# Altium schematic sheet ESP-RX.SchDoc: ESP-RX
size A; SheetNumber: 3; SheetTotal: 8
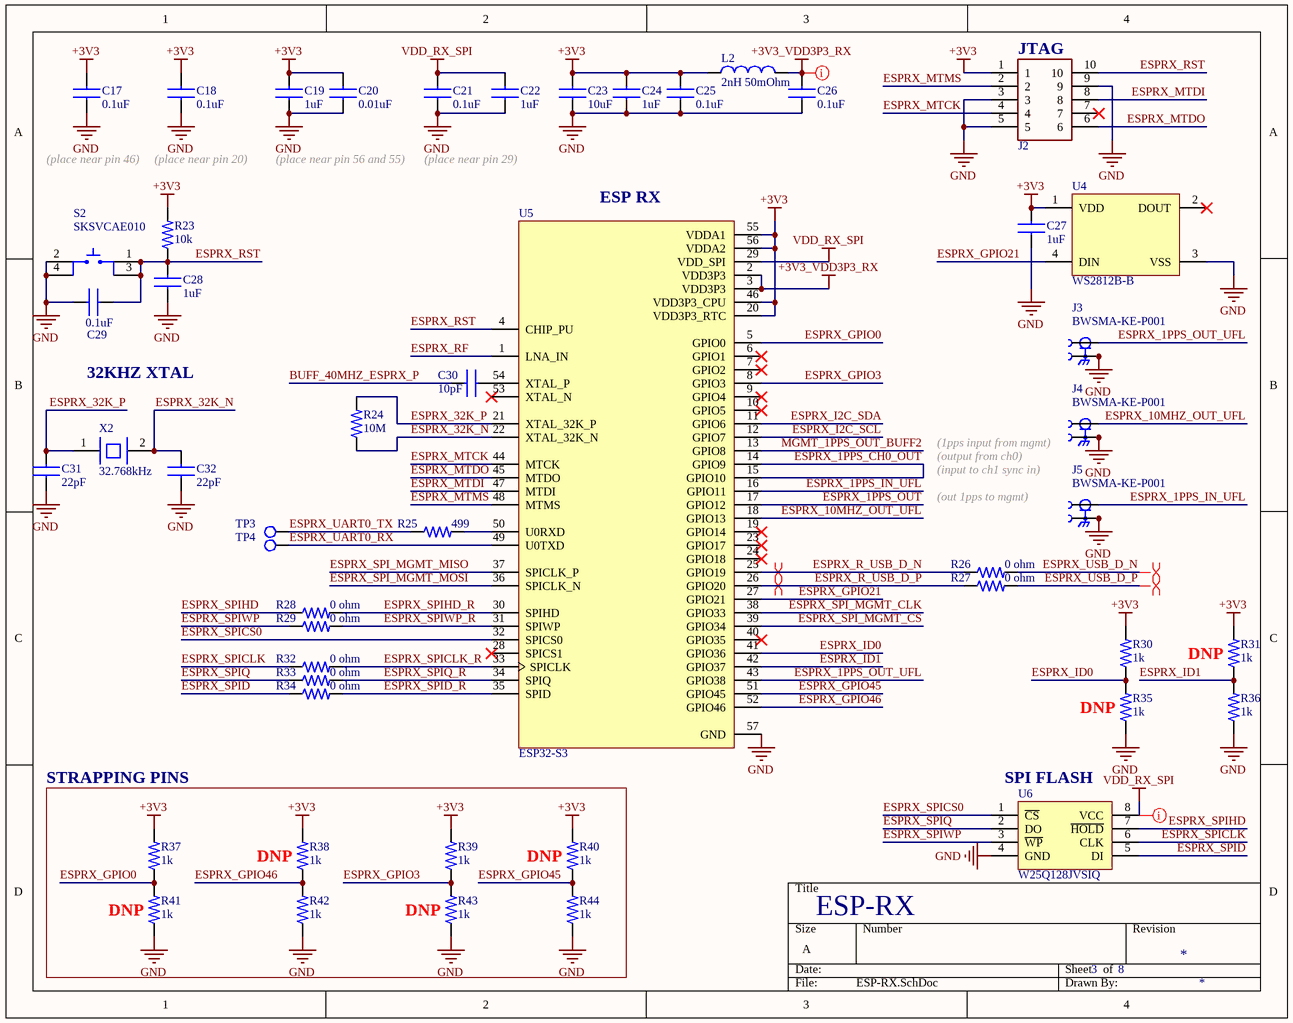
[diagram p0: ESP-RX.SchDoc]

## Parts
C17  0.1uF  [CAP_0402]
C18  0.1uF  [CAP_0402]
C19  1uF  [CAP_0402]
C20  0.01uF  [CAP_0402]
C21  0.1uF  [CAP_0402]
C22  1uF  [CAP_0402]
C23  10uF  [CAP_0402]
C24  1uF  [CAP_0402]
C25  0.1uF  [CAP_0402]
C26  0.1uF  [CAP_0402]
C27  1uF  [CAP_0402]
C28  1uF  [CAP_0402]
C29  0.1uF  [CAP_0402]
C30  10pF  [CAP_0402]
C31  22pF  [CAP_0402]
C32  22pF  [CAP_0402]
J2  CONN_TC2050-IDC  [CONN_TAG-CONNECT_TC2050-IDC]  (value not drawn)
J3  BWSMA-KE-P001  [CONN_BWSMA-KE-P001]
J4  BWSMA-KE-P001  [CONN_BWSMA-KE-P001]
J5  BWSMA-KE-P001  [CONN_BWSMA-KE-P001]
L2  2nH 50mOhm  [IND_INDC1006X60N]
R23  10k  [RES_0402]
R24  10M  [RES_0402]
R25  499  [RES_0402]
R26  0 ohm  [RES_0402]
R27  0 ohm  [RES_0402]
R28  0 ohm  [RES_0402]
R29  0 ohm  [RES_0402]
R30  1k  [RES_0402]
R31  1k  [RES_0402]  (no BOM)
R32  0 ohm  [RES_0402]
R33  0 ohm  [RES_0402]
R34  0 ohm  [RES_0402]
R35  1k  [RES_0402]  (no BOM)
R36  1k  [RES_0402]
R37  1k  [RES_0402]
R38  1k  [RES_0402]  (no BOM)
R39  1k  [RES_0402]
R40  1k  [RES_0402]  (no BOM)
R41  1k  [RES_0402]  (no BOM)
R42  1k  [RES_0402]
R43  1k  [RES_0402]  (no BOM)
R44  1k  [RES_0402]
S2  SKSVCAE010  [SW_SKSVCAE010]
TP3  Test Point 1MM  [TP_PAD-1MM]  (value not drawn)  (no BOM)
TP4  Test Point 1MM  [TP_PAD-1MM]  (value not drawn)  (no BOM)
U4  WS2812B-B  [LED_WS2812B-B]
U5  ESP32-S3  [IC_ESP32-S3]
U6  W25Q128JVSIQ  [IC_W25Q128JVSIQ]
X2  32.768kHz  [XTAL_X321532768KGD2SI]

## Nets
+3V3: C17.2 C18.2 C19.2 C20.2 C23.2 C24.2 C25.2 C27.2 J2.1 L2.1 R23.2 R30.2 R31.2 R37.2 R38.2 R39.2 R40.2 U4.1(VDD) U5.20(VDD3P3_RTC) U5.46(VDD3P3_CPU) U5.55(VDDA1) U5.56(VDDA2)
+3V3_VDD3P3_RX: C26.2 L2.2 U5.2(VDD3P3) U5.3(VDD3P3)
GND: C17.1 C18.1 C19.1 C20.1 C21.1 C22.1 C23.1 C24.1 C25.1 C26.1 C27.1 C28.1 C29.1 C31.1 C32.1 J2.3 J2.5 J2.9 J3.2 J3.3 J3.4 J3.5 J4.2 J4.3 J4.4 J4.5 J5.2 J5.3 J5.4 J5.5 R35.1 R36.1 R41.1 R42.1 R43.1 R44.1 S2.2 S2.4 U4.3(VSS) U5.57(GND) U6.4(GND)
VDD_RX_SPI: C21.2 C22.2 U5.29(VDD_SPI) U6.8(VCC)
BUFF_40MHZ_ESPRX_P: C30.1
ESPRX_1PPS_CH0_OUT: U5.14(GPIO9) U5.15(GPIO10)
ESPRX_1PPS_IN_UFL: J5.1 U5.16(GPIO11)
ESPRX_1PPS_OUT: U5.17(GPIO12)
ESPRX_1PPS_OUT_UFL: J3.1 U5.43(GPIO38)
ESPRX_10MHZ_OUT_UFL: J4.1 U5.18(GPIO13)
ESPRX_32K_N: C32.2 R24.1 U5.22(XTAL_32K_N) X2.2(GND)
ESPRX_32K_P: C31.2 R24.2 U5.21(XTAL_32K_P) X2.1(IN/OUT)
ESPRX_GPIO0: R37.1 R41.2 U5.5(GPIO0)
ESPRX_GPIO3: R39.1 R43.2 U5.8(GPIO3)
ESPRX_GPIO21: U4.4(DIN) U5.27(GPIO21)
ESPRX_GPIO45: R40.1 R44.2 U5.51(GPIO45)
ESPRX_GPIO46: R38.1 R42.2 U5.52(GPIO46)
ESPRX_I2C_SCL: U5.12(GPIO7)
ESPRX_I2C_SDA: U5.11(GPIO6)
ESPRX_ID0: R30.1 R35.2 U5.41(GPIO36)
ESPRX_ID1: R31.1 R36.2 U5.42(GPIO37)
ESPRX_MTCK: J2.4 U5.44(MTCK)
ESPRX_MTDI: J2.8 U5.47(MTDI)
ESPRX_MTDO: J2.6 U5.45(MTDO)
ESPRX_MTMS: J2.2 U5.48(MTMS)
ESPRX_R_USB_D_N: R26.1 U5.25(GPIO19)
ESPRX_R_USB_D_P: R27.1 U5.26(GPIO20)
ESPRX_RF: U5.1(LNA_IN)
ESPRX_RST: C28.2 C29.2 J2.10 R23.1 S2.1 S2.3 U5.4(CHIP_PU)
ESPRX_SPI_MGMT_CLK: U5.38(GPIO33)
ESPRX_SPI_MGMT_CS: U5.39(GPIO34)
ESPRX_SPI_MGMT_MISO: U5.37(SPICLK_P)
ESPRX_SPI_MGMT_MOSI: U5.36(SPICLK_N)
ESPRX_SPICLK: R32.1 U6.6(CLK)
ESPRX_SPICLK_R: R32.2 U5.33(SPICLK)
ESPRX_SPICS0: U5.32(SPICS0) U6.1(~{CS})
ESPRX_SPID: R34.1 U6.5(DI)
ESPRX_SPID_R: R34.2 U5.35(SPID)
ESPRX_SPIHD: R28.1 U6.7(~{HOLD})
ESPRX_SPIHD_R: R28.2 U5.30(SPIHD)
ESPRX_SPIQ: R33.1 U6.2(DO)
ESPRX_SPIQ_R: R33.2 U5.34(SPIQ)
ESPRX_SPIWP: R29.1 U6.3(~{WP})
ESPRX_SPIWP_R: R29.2 U5.31(SPIWP)
ESPRX_UART0_RX: TP4.1 U5.49(U0TXD)
ESPRX_UART0_TX: R25.1 TP3.1
ESPRX_USB_D_N: R26.2
ESPRX_USB_D_P: R27.2
MGMT_1PPS_OUT_BUFF2: U5.13(GPIO8)
NetC30_2: C30.2 U5.54(XTAL_P)
NetR25_2: R25.2 U5.50(U0RXD)

Not connected (* = marked no-connect by the designer): J2 7*; U4 2(DOUT)*; U5 6(GPIO1)* 7(GPIO2)* 9(GPIO4)* 10(GPIO5)* 19(GPIO14)* 23(GPIO17)* 24(GPIO18)* 28(SPICS1)* 40(GPIO35)* 53(XTAL_N)*

## Layout directives
differential pair: ESPRX_R_USB_D_N, ESPRX_R_USB_D_P, ESPRX_USB_D_N, ESPRX_USB_D_P
net class Power: +3V3_VDD3P3_RX, VDD_RX_SPI

## Notes on the sheet
- (near J2) JTAG
- (place near pin 46)
- (place near pin 20)
- (place near pin 56 and 55)
- (place near pin 29)
- (near U5) ESP RX
- 32KHZ XTAL
- (input to ch1 sync in)
- (output from ch0)
- (near J5) (out 1pps to mgmt)
- (near J4) (1pps input from mgmt)
- (near R35) DNP
- (near R31) DNP
- STRAPPING PINS
- (near U6) SPI FLASH
- (near R41) DNP
- (near R38) DNP
- (near R43) DNP
- (near R40) DNP

## Library data of the parts
C17 C18 C21 C25 C26 C29 = CAP_GCM155R71C104KA55J: Cap Ceramic 0.1uF 16V X7R 10% SMD 0402 125C Paper T/R; Manufacturer: Murata; Capacitance: 100nF; Supplier 1: Digi-Key; Manufacturer Part Number: GCM155R71C104KA55J; RoHS: Yes; Category: Ceramic Capacitors; Stock 1: 10738061; Pricing 1: 1=0.10000, 10=0.03500, 50=0.01920, 100=0.01560, 500=0.01116, 1000=0.00877, 2500=0.00798, 5000=0.00734 (USD); Mount: Surface Mount; Case/Package: 0402; Case Code (Imperial): 0402; Case Code (Metric): 1005; Min Operating Temperature: -55°C; Max Operating Temperature: 125°C; Tolerance: 10%; Voltage Rating: 16V; Voltage Rating (DC): 16V; Packaging: Tape and Reel; Package Quantity: 1; Dielectric: X7R; Termination: SMD/SMT; Series: GCM; Construction: Flat; Length: 1mm; Width: 0.5mm; Height: 0.5mm; Thickness: 0.022inch; Depth: 0.5mm; Ratings: AEC-Q200; Radiation Hardening: No; Lead Free: Lead Free; ComponentLink1URL: https://datasheet.ciiva.com/11618/product-11618848.pdf?src-supplier=Avnet; ComponentLink1Description: https://datasheet.ciiva.com/11618/product-11618848.pdf?src-supplier=Avnet; ComponentLink2URL: https://datasheet.ciiva.com/16440/gcm155r71c104ka55j-16440393.pdf?src-supplier=Future+Electronics; ComponentLink2Description: https://datasheet.ciiva.com/16440/gcm155r71c104ka55j-16440393.pdf?src-supplier=Future+Electronics; ComponentLink3URL: https://datasheet.ciiva.com/29542/product-29542474.pdf?src-supplier=Digi-Key; ComponentLink3Description: https://datasheet.ciiva.com/29542/product-29542474.pdf?src-supplier=Digi-Key; ComponentLink4URL: https://datasheet.ciiva.com/29542/product-29542475.pdf?src-supplier=Digi-Key; ComponentLink4Description: https://datasheet.ciiva.com/29542/product-29542475.pdf?src-supplier=Digi-Key; Supplier Part Number 1: 490-7998-1-ND
C19 C22 C24 C27 C28 = CAP_CL05A105KA5NQNC: Cap Ceramic 1uF 25V X5R 10% SMD 0402 85°C Cardboard T/R; Manufacturer: Samsung; Supplier 1: Digi-Key; Manufacturer Part Number: CL05A105KA5NQNC; RoHS: Yes; Category: Ceramic Capacitors; Pricing 1: 1=0.21000, 10=0.14900, 50=0.08460, 100=0.07000, 500=0.04910, 1000=0.04065, 2500=0.03784, 5000=0.03462 (USD); Mount: Surface Mount; Case/Package: 0402; Case Code (Metric): 1005; Case Code (Imperial): 0402; Material: Ceramic; Min Operating Temperature: -55°C; Max Operating Temperature: 85°C; Tolerance: 10%; Capacitance: 1uF; Voltage Rating: 25V; Packaging: Tape and Reel; Package Quantity: 10000; Dielectric: X5R; Series: CL; Construction: Flat; Length: 1mm; Width: 0.02inch; Height: 0.5mm; Depth: 0.5mm; Thickness: 0.022inch; Radiation Hardening: No; Lead Free: Lead Free; RoHS Compliant: Yes; ComponentLink1URL: https://datasheet.ciiva.com/3777/cl05a105ka5nqnc-3777709.pdf?src-supplier=Arrow+Electronics; ComponentLink1Description: https://datasheet.ciiva.com/3777/cl05a105ka5nqnc-3777709.pdf?src-supplier=Arrow+Electronics; ComponentLink2URL: https://datasheet.ciiva.com/25720/cl05a105ka5nqnc-25720771.pdf?src-supplier=Digi-Key; ComponentLink2Description: https://datasheet.ciiva.com/25720/cl05a105ka5nqnc-25720771.pdf?src-supplier=Digi-Key; ComponentLink3URL: https://datasheet.ciiva.com/29198/459147-da-01-en-vs-kondensator-0402-29198339.pdf?src-supplier=Conrad; ComponentLink3Description: https://datasheet.ciiva.com/29198/459147-da-01-en-vs-kondensator-0402-29198339.pdf?src-supplier=Conrad; Supplier Part Number 1: 1276-1445-6-ND
C20 = CAP_CC0402KRX7R9BB103: Cap Ceramic 0.01uF 50V X7R 10% Pad SMD 0402 125°C T/R; Manufacturer: Yageo; Capacitance: 10nF; Supplier 1: Digi-Key; Manufacturer Part Number: CC0402KRX7R9BB103; RoHS: Yes; Category: Ceramic Capacitors; Stock 1: 2049089; Pricing 1: 1=0.10000, 10=0.01800, 50=0.01000, 100=0.00820, 500=0.00588, 1000=0.00462, 2500=0.00420, 5000=0.00386 (USD); Mount: Surface Mount; Case/Package: 0402; Case Code (Imperial): 0402; Case Code (Metric): 1005; Min Operating Temperature: -55°C; Max Operating Temperature: 125°C; Tolerance: 10%; Dielectric: X7R; Packaging: Tape and Reel; Voltage Rating: 50V; Voltage Rating (DC): 50V; Package Quantity: 1; Termination: SMD/SMT; Resistor Type: Ceramic; Voltage: 50V; Series: CC; Length: 1mm; Width: 0.5mm; Height: 0.5mm; Thickness: 0.022inch; Depth: 0.5mm; Radiation Hardening: No; RoHS Compliant: Yes; REACH SVHC: No SVHC; Lead Free: Lead Free; Halogen Free: Halogen Free; ComponentLink1URL: https://datasheet.ciiva.com/11788/0900766b8079c870-11788375.pdf?src-supplier=RSComponents; ComponentLink1Description: https://datasheet.ciiva.com/11788/0900766b8079c870-11788375.pdf?src-supplier=RSComponents; ComponentLink2URL: https://datasheet.ciiva.com/26862/getdatasheetpartid-138248-26862642.pdf?src-supplier=Verical; ComponentLink2Description: https://datasheet.ciiva.com/26862/getdatasheetpartid-138248-26862642.pdf?src-supplier=Verical; ComponentLink3URL: https://datasheet.ciiva.com/7978/1489800-7978093.pdf?src-supplier=Element14; ComponentLink3Description: https://datasheet.ciiva.com/7978/1489800-7978093.pdf?src-supplier=Element14; ComponentLink4URL: https://datasheet.ciiva.com/28450/1489800-28450377.pdf?src-supplier=Element14; ComponentLink4Description: https://datasheet.ciiva.com/28450/1489800-28450377.pdf?src-supplier=Element14; ComponentLink5URL: https://datasheet.ciiva.com/176/mlccorderingcode-176349.pdf?src-supplier=Digi-Key; ComponentLink5Description: https://datasheet.ciiva.com/176/mlccorderingcode-176349.pdf?src-supplier=Digi-Key; ComponentLink6URL: https://datasheet.ciiva.com/176/mlccorderingcode-176348.pdf?src-supplier=Digi-Key; ComponentLink6Description: https://datasheet.ciiva.com/176/mlccorderingcode-176348.pdf?src-supplier=Digi-Key; ComponentLink7URL: https://datasheet.ciiva.com/176/mlccorderingcode-176350.pdf?src-supplier=Digi-Key; ComponentLink7Description: https://datasheet.ciiva.com/176/mlccorderingcode-176350.pdf?src-supplier=Digi-Key; ComponentLink8URL: https://datasheet.ciiva.com/16625/upy-gphc-x7r-6-3v-to-50v-8-16625513.pdf?src-supplier=Avnet+Europe; ComponentLink8Description: https://datasheet.ciiva.com/16625/upy-gphc-x7r-6-3v-to-50v-8-16625513.pdf?src-supplier=Avnet+Europe; Supplier Part Number 1: 311-1349-1-ND
C23 = CAP_CL05A106MQ5NUNC: Cap Ceramic 10uF 6.3V X5R 20% SMD 0402 85°C Paper T/R; Manufacturer: Samsung; Supplier 1: Digi-Key; Manufacturer Part Number: CL05A106MQ5NUNC; RoHS: Yes; Category: Ceramic Capacitors; Stock 1: 3345553; Pricing 1: 1=0.27000, 10=0.18400, 50=0.11020, 100=0.09300, 500=0.06362, 1000=0.05629, 2500=0.05384, 5000=0.04894 (USD); Mount: Surface Mount; Case/Package: 0402; Case Code (Metric): 1005; Case Code (Imperial): 0402; Min Operating Temperature: -55°C; Max Operating Temperature: 85°C; Tolerance: 20%; Capacitance: 10uF; Dielectric: X5R; Packaging: Tape and Reel; Package Quantity: 1; Voltage Rating: 6.3V; Series: CL; Construction: Flat; Length: 1mm; Width: 0.02inch; Height: 0.5mm; Thickness: 0.028inch; Depth: 0.5mm; Radiation Hardening: No; ComponentLink1URL: https://datasheet.ciiva.com/16437/cl05a106mq5nunc-16437356.pdf?src-supplier=Future+Electronics; ComponentLink1Description: https://datasheet.ciiva.com/16437/cl05a106mq5nunc-16437356.pdf?src-supplier=Future+Electronics; ComponentLink2URL: https://datasheet.ciiva.com/26877/getdatasheetpartid-355289-26877841.pdf?src-supplier=Verical; ComponentLink2Description: https://datasheet.ciiva.com/26877/getdatasheetpartid-355289-26877841.pdf?src-supplier=Verical; Supplier Part Number 1: 1276-1451-1-ND
C30 = CAP_CGA2B2NP01H100D050BA: Cap Ceramic 10pF 50V C0G 0.5pF Pad SMD 0402 150C Automotive T/R; Manufacturer: TDK; Supplier 1: Digi-Key; Manufacturer Part Number: CGA2B2NP01H100D050BA; RoHS: Yes; Category: Ceramic Capacitors; Stock 1: 696060; Pricing 1: 1=0.1, 10=0.072, 50=0.0408, 100=0.0338, 500=0.02372, 1000=0.01964, 2500=0.01828, 5000=0.01672 (USD); Mounting Technology: Surface Mount; Case/Package: 0402; Case Code (Metric): 1005; Case Code (Imperial): 0402; Weight: 2.3E-05oz; Min Operating Temperature: -55°C; Max Operating Temperature: 150°C; Package Quantity: 1; Packaging: Tape and Reel; Value: 10pF; Voltage Rating: 50V; Dielectric: C0G; Termination: SMD/SMT; Voltage Rating (DC): 50V; Features: High Temperature; Series: CGA; Length: 0.039inch; Width: 0.02inch; Height: 0.5mm; Thickness: 0.022inch; Ratings: AEC-Q200; Lead Free: Lead Free; RoHS Compliant: Yes; ComponentLink1URL: http://www.farnell.com/datasheets/2628288.pdf?src-supplier=Farnell; ComponentLink1Description: http://www.farnell.com/datasheets/2628288.pdf?src-supplier=Farnell; ComponentLink2URL: http://www.mouser.com/ds/2/400/mlcc_automotive_hightemp_en-520039.pdf?src-supplier=Mouser; ComponentLink2Description: http://www.mouser.com/ds/2/400/mlcc_automotive_hightemp_en-520039.pdf?src-supplier=Mouser; ComponentLink3URL: http://product.tdk.com/en/catalog/datasheets/mlcc_automotive_hightemp_en.pdf?src-supplier=Avnet; ComponentLink3Description: http://product.tdk.com/en/catalog/datasheets/mlcc_automotive_hightemp_en.pdf?src-supplier=Avnet; ComponentLink4URL: https://product.tdk.com/info/en/documents/chara_sheet/CGA2B2NP01H100D050BA.pdf?src-supplier=Digi-Key; ComponentLink4Description: https://product.tdk.com/info/en/documents/chara_sheet/CGA2B2NP01H100D050BA.pdf?src-supplier=Digi-Key; ComponentLink5URL: http://www.farnell.com/datasheets/2628288.pdf?src-supplier=Element14; ComponentLink5Description: http://www.farnell.com/datasheets/2628288.pdf?src-supplier=Element14; ComponentLink6URL: http://www.farnell.com/datasheets/2628288.pdf?src-supplier=Newark; ComponentLink6Description: http://www.farnell.com/datasheets/2628288.pdf?src-supplier=Newark; Supplier Part Number 1: 445-12120-1-ND
C31 C32 = CAP_CC0402JRNPO9BN220: 0402 22 pF 50 V ±5 % Tolerance NP0 SMT Multilayer Ceramic Capacitor; Manufacturer: Yageo; Tolerance: 5%; Dielectric: C0G; Voltage Rating (DC): 50V; Temperature Coefficient: 30ppm/°C; Insulation Resistance: 100GR; Supplier 1: Digi-Key; Manufacturer Part Number: CC0402JRNPO9BN220; RoHS: Yes; Category: Ceramic Capacitors; Stock 1: 1052; Pricing 1: 1=0.10000, 10=0.02200, 50=0.01180, 100=0.00960, 500=0.00688, 1000=0.00541, 2500=0.00492, 5000=0.00452 (USD); Mount: Surface Mount; Case/Package: 0402; Number of Pins: 2; Dielectric Material: Ceramic; Case Code (Metric): 1005; Case Code (Imperial): 0402; Min Operating Temperature: -55°C; Max Operating Temperature: 125°C; Capacitance: 22pF; Voltage: 50V; Series: CC; Voltage Rating: 50V; Packaging: Tape and Reel; Package Quantity: 1; Termination: SMD/SMT; Resistor Type: Ceramic; Length: 1mm; Width: 0.02inch; Height: 0.5mm; Depth: 0.5mm; Thickness: 0.022inch; Radiation Hardening: No; REACH SVHC: No SVHC; Lead Free: Lead Free; RoHS Compliant: Yes; ComponentLink1URL: https://datasheet.ciiva.com/143/mlccorderingcode-143986.pdf?src-supplier=Digi-Key; ComponentLink1Description: https://datasheet.ciiva.com/143/mlccorderingcode-143986.pdf?src-supplier=Digi-Key; ComponentLink2URL: https://datasheet.ciiva.com/143/mlccorderingcode-143987.pdf?src-supplier=Digi-Key; ComponentLink2Description: https://datasheet.ciiva.com/143/mlccorderingcode-143987.pdf?src-supplier=Digi-Key; ComponentLink3URL: https://datasheet.ciiva.com/143/mlccorderingcode-143988.pdf?src-supplier=Digi-Key; ComponentLink3Description: https://datasheet.ciiva.com/143/mlccorderingcode-143988.pdf?src-supplier=Digi-Key; ComponentLink4URL: https://datasheet.ciiva.com/5789/1443161-5789509.pdf?src-supplier=Farnell; ComponentLink4Description: https://datasheet.ciiva.com/5789/1443161-5789509.pdf?src-supplier=Farnell; ComponentLink5URL: https://datasheet.ciiva.com/5425/upy-gp-np0-16v-to-50v-8-5425483.pdf?src-supplier=Mouser; ComponentLink5Description: https://datasheet.ciiva.com/5425/upy-gp-np0-16v-to-50v-8-5425483.pdf?src-supplier=Mouser; ComponentLink6URL: https://datasheet.ciiva.com/15189/getdatasheetpartid-370074-15189117.pdf?src-supplier=Verical; ComponentLink6Description: https://datasheet.ciiva.com/15189/getdatasheetpartid-370074-15189117.pdf?src-supplier=Verical; ComponentLink7URL: https://datasheet.ciiva.com/7656/1132289-7656615.pdf?src-supplier=Element14; ComponentLink7Description: https://datasheet.ciiva.com/7656/1132289-7656615.pdf?src-supplier=Element14; ComponentLink8URL: https://datasheet.ciiva.com/16625/upy-gp-np0-16v-to-50v-8-16625509.pdf?src-supplier=Avnet+Europe; ComponentLink8Description: https://datasheet.ciiva.com/16625/upy-gp-np0-16v-to-50v-8-16625509.pdf?src-supplier=Avnet+Europe; ComponentLink9URL: https://datasheet.ciiva.com/8033/1443161-8033605.pdf?src-supplier=Element14; ComponentLink9Description: https://datasheet.ciiva.com/8033/1443161-8033605.pdf?src-supplier=Element14; ComponentLink10URL: https://datasheet.ciiva.com/8033/1443161-8033606.pdf?src-supplier=Element14; ComponentLink10Description: https://datasheet.ciiva.com/8033/1443161-8033606.pdf?src-supplier=Element14; ComponentLink11URL: https://datasheet.ciiva.com/8033/1443161-8033607.pdf?src-supplier=Element14; ComponentLink11Description: https://datasheet.ciiva.com/8033/1443161-8033607.pdf?src-supplier=Element14; Supplier Part Number 1: 311-1018-1-ND
J2 = CONN_TC2050-IDC: Cbl Plug-Of-Nails 10-Pin w/Legs; MF: {'manufacturer': u'Tag-Connect LLC'}; Availability: Unavailable; Price: None; Value: *; MP: TC2050-IDC; Package: None
J3-J5 = CONN_BWSMA-KE-P001: 0-12.4GHz 50Ω 335V 直插偏脚; Manufacturer: BAT Wireless; Supplier 1: LCSC; Manufacturer Part Number: BWSMA-KE-P001; RoHS: No; Stock 1: 21382; Pricing 1: 1=0.3453, 10=0.2721, 30=0.2355, 100=0.2037, 500=0.1957, 1000=0.1894 (USD); Supplier Part Number 1: C496550
L2 = IND_MHQ1005P2N0STD25: FIXED IND 2NH 1A 50 MOHM SMD; MF: {'manufacturer': u'TDK'}; Availability: Unavailable; Price: None; Value: *; MP: MHQ1005P2N0STD25; Package: None
R23 = RES_AC0402FR-0710KL: RES SMD 10K OHM 1% 1/16W 0402; Manufacturer: Yageo; Resistance: 10kR; Power Rating: 62.5mW; Voltage Rating: 50V; Temperature Coefficient: 100ppm/°C; Max Power Dissipation: 63mW; Supplier 1: Digi-Key; Manufacturer Part Number: AC0402FR-0710KL; RoHS: Yes; Category: Chip SMD Resistors; Stock 1: 2860; Pricing 1: 1=0.10000, 10=0.02200, 100=0.00900, 1000=0.00402, 2500=0.00349, 5000=0.00288 (USD); Case/Package: 0402; Case Code (Imperial): 0402; Case Code (Metric): 1005; Size Code: 0402; Min Operating Temperature: -55°C; Max Operating Temperature: 155°C; Tolerance: 1%; Packaging: Tape and Reel; Resistor Type: Thick Film; Termination: SMD/SMT; Number of Terminations: 2; Features: Moisture Resistant,Automotive AEC-Q200; Series: AC; Construction: Rectangular; Length: 0.039inch; Width: 0.02inch; Height: 0.015inch; Depth: 0.5mm; Military Standard: Not; Lead Free: Lead Free; RoHS Compliant: Yes; ComponentLink1URL: https://datasheet.ciiva.com/12656/pyu-ac-51-rohs-l-2-12656634.pdf?src-supplier=Mouser; ComponentLink1Description: https://datasheet.ciiva.com/12656/pyu-ac-51-rohs-l-2-12656634.pdf?src-supplier=Mouser; Supplier Part Number 1: YAG3436CT-ND
R24 = RES_CRGCQ0402J10M: Res Thick Film 0402 10M Ohm 5% 0.063W(1/16W) ±100ppm/C Pad SMD Automotive T/R; Manufacturer: TE Connectivity; Value: 10MR; Max Power Dissipation: 63mW; Temperature Coefficient: 100ppm/°C; Supplier 1: Digi-Key; Manufacturer Part Number: CRGCQ0402J10M; RoHS: Yes; Category: Chip SMD Resistors; Stock 1: 23325092; Pricing 1: 1=0.1, 10=0.018, 50=0.01, 100=0.0073, 500=0.00448, 1000=0.00329, 5000=0.00236 (USD); Case/Package: 0402; Min Operating Temperature: -55°C; Max Operating Temperature: 155°C; Features: Moisture Resistant,Automotive AEC-Q200; Tolerance: 5%; Number of Terminations: 2; Series: CRGCQ; Ratings: AEC-Q200; RoHS Compliant: Yes; ComponentLink1URL: https://www.te.com/commerce/DocumentDelivery/DDEController?Action=srchrtrv&amp;DocNm=1773204-3&amp;DocType=DS&amp;DocLang=English&src-supplier=Digi-Key; ComponentLink1Description: https://www.te.com/commerce/DocumentDelivery/DDEController?Action=srchrtrv&amp;DocNm=1773204-3&amp;DocType=DS&amp;DocLang=English&src-supplier=Digi-Key; Supplier Part Number 1: A130072CT-ND
R25 = RES_RC0402FR-07499RL: Res General Purpose Thick Film 0402 499 Ohm 1% 1/16W ±100ppm/°C Molded SMD Paper T/R; Manufacturer: Yageo; Value: 499R; Power Rating: 62.5mW; Voltage Rating: 50V; Max Power Dissipation: 63mW; Supplier 1: Digi-Key; Manufacturer Part Number: RC0402FR-07499RL; RoHS: Yes; Category: Chip SMD Resistors; Stock 1: 3392494; Pricing 1: 1=0.1, 10=0.015, 50=0.009, 100=0.0074, 500=0.00492, 1000=0.00421, 5000=0.003 (USD); Case/Package: 0402; Case Code (Metric): 1005; Case Code (Imperial): 0402; Min Operating Temperature: -55°C; Max Operating Temperature: 155°C; Tolerance: 1%; Package Quantity: 1; Packaging: Tape and Reel; Resistor Type: Thick Film; Number of Terminations: 2; Termination: SMD/SMT; Temperature Coefficient: 100ppm/°C; Voltage Rating (DC): 50V; Features: Moisture Resistant; Series: RC; Resistance Tolerance: 1%; Construction: Rectangular; Length: 0.039inch; Width: 0.02inch; Height: 0.016inch; Depth: 0.5mm; RoHS Compliant: Yes; Reach SVHC Compliant: No; Military Standard: Not; Lead Free: Lead Free; ComponentLink1URL: https://datasheet.ciiva.com/2453/pyu-r-int-thick-7-2453539.pdf?src-supplier=Digi-Key; ComponentLink1Description: https://datasheet.ciiva.com/2453/pyu-r-int-thick-7-2453539.pdf?src-supplier=Digi-Key; ComponentLink2URL: https://datasheet.ciiva.com/2453/pyu-r-int-thick-7-2453540.pdf?src-supplier=Digi-Key; ComponentLink2Description: https://datasheet.ciiva.com/2453/pyu-r-int-thick-7-2453540.pdf?src-supplier=Digi-Key; ComponentLink3URL: https://datasheet.ciiva.com/2453/pyu-r-int-thick-7-2453538.pdf?src-supplier=Digi-Key; ComponentLink3Description: https://datasheet.ciiva.com/2453/pyu-r-int-thick-7-2453538.pdf?src-supplier=Digi-Key; Supplier Part Number 1: 311-499LRCT-ND
R26-R29 R32-R34 = RES_RC0402JR-070RL: RES SMD 0 OHM JUMPER 1/16W 0402; Manufacturer: Yageo; Value: 0mR; Power Rating: 62.5mW; Tolerance: 5%; Voltage Rating: 50V; Max Power Dissipation: 63mW; Temperature Coefficient: 200ppm/°C; Supplier 1: Digi-Key; Manufacturer Part Number: RC0402JR-070RL; RoHS: Yes; Category: Chip SMD Resistors; Stock 1: 33185339; Pricing 1: 1=0.10000, 10=0.01200, 25=0.00840, 50=0.00640, 100=0.00480, 250=0.00364, 500=0.00290, 1000=0.00214, 5000=0.00154 (USD); Case/Package: 0402; Case Code (Metric): 1005; Case Code (Imperial): 0402; Contact Plating: Tin,Matte; Min Operating Temperature: -55°C; Max Operating Temperature: 155°C; Package Quantity: 1; Packaging: Tape and Reel; Resistor Type: Thick Film; Number of Terminations: 2; Termination: SMD/SMT; Features: Moisture Resistant; Series: RC; Technology: THICK FILM; Resistance Tolerance: 5%; Construction: Rectangular; Length: 1mm; Width: 0.02inch; Height: 0.016inch; Depth: 0.5mm; Radiation Hardening: No; Military Standard: Not; Lead Free: Lead Free; RoHS Compliant: Yes; ComponentLink1URL: https://datasheet.ciiva.com/2452/pyu-rc0402-51-rohs-l-6-2452608.pdf?src-supplier=Digi-Key; ComponentLink1Description: https://datasheet.ciiva.com/2452/pyu-rc0402-51-rohs-l-6-2452608.pdf?src-supplier=Digi-Key; ComponentLink2URL: https://datasheet.ciiva.com/7983/1018594-7983535.pdf?src-supplier=Element14; ComponentLink2Description: https://datasheet.ciiva.com/7983/1018594-7983535.pdf?src-supplier=Element14; ComponentLink3URL: https://datasheet.ciiva.com/22747/1018594-22747515.pdf?src-supplier=Element14; ComponentLink3Description: https://datasheet.ciiva.com/22747/1018594-22747515.pdf?src-supplier=Element14; ComponentLink4URL: https://datasheet.ciiva.com/2452/pyu-r-int-thick-7-2452609.pdf?src-supplier=Digi-Key; ComponentLink4Description: https://datasheet.ciiva.com/2452/pyu-r-int-thick-7-2452609.pdf?src-supplier=Digi-Key; ComponentLink5URL: https://datasheet.ciiva.com/2452/pyu-r-int-thick-7-2452610.pdf?src-supplier=Digi-Key; ComponentLink5Description: https://datasheet.ciiva.com/2452/pyu-r-int-thick-7-2452610.pdf?src-supplier=Digi-Key; ComponentLink6URL: https://datasheet.ciiva.com/8896/pyu-rc0402-51-rohs-l-6-8896201.pdf?src-supplier=Avnet; ComponentLink6Description: https://datasheet.ciiva.com/8896/pyu-rc0402-51-rohs-l-6-8896201.pdf?src-supplier=Avnet; ComponentLink7URL: https://datasheet.ciiva.com/15189/getdatasheetpartid-326379-15189533.pdf?src-supplier=Verical; ComponentLink7Description: https://datasheet.ciiva.com/15189/getdatasheetpartid-326379-15189533.pdf?src-supplier=Verical; Supplier Part Number 1: 311-0.0JRCT-ND
R30 R31 R35-R44 = RES_RC0402JR-071KL: Res General Purpose Thick Film 0402 1K Ohm 5% 1/16W ±100ppm/°C Molded SMD Paper T/R; Manufacturer: Yageo; Resistance: 1kR; Power Rating: 62.5mW; Voltage Rating: 50V; Max Power Dissipation: 63mW; Supplier 1: Digi-Key; Manufacturer Part Number: RC0402JR-071KL; RoHS: Yes; Category: Chip SMD Resistors; Stock 1: 1442131; Pricing 1: 1=0.10000, 10=0.01300, 100=0.00540, 1000=0.00244, 2500=0.00212, 5000=0.00175 (USD); Case/Package: 0402; Case Code (Imperial): 0402; Case Code (Metric): 1005; Size Code: 0402; Min Operating Temperature: -55°C; Max Operating Temperature: 155°C; Tolerance: 5%; Packaging: Tape and Reel; Package Quantity: 1; Termination: SMD/SMT; Resistor Type: Thick Film; Number of Terminations: 2; Temperature Coefficient: 100ppm/°C; Features: Moisture Resistant; Series: RC; Resistance Tolerance: 5%; Construction: Rectangular; Length: 0.039inch; Width: 0.02inch; Height: 0.016inch; Depth: 0.5mm; REACH SVHC: No SVHC; Military Standard: Not; Lead Free: Lead Free; RoHS Compliant: Yes; ComponentLink1URL: https://datasheet.ciiva.com/2452/pyu-r-int-thick-7-2452755.pdf?src-supplier=Digi-Key; ComponentLink1Description: https://datasheet.ciiva.com/2452/pyu-r-int-thick-7-2452755.pdf?src-supplier=Digi-Key; ComponentLink2URL: https://datasheet.ciiva.com/2452/pyu-r-int-thick-7-2452756.pdf?src-supplier=Digi-Key; ComponentLink2Description: https://datasheet.ciiva.com/2452/pyu-r-int-thick-7-2452756.pdf?src-supplier=Digi-Key; ComponentLink3URL: https://datasheet.ciiva.com/2452/pyu-r-int-thick-7-2452757.pdf?src-supplier=Digi-Key; ComponentLink3Description: https://datasheet.ciiva.com/2452/pyu-r-int-thick-7-2452757.pdf?src-supplier=Digi-Key; ComponentLink4URL: https://datasheet.ciiva.com/17081/pyu-rc0402-51-rohs-l-6-r-17081438.pdf?src-supplier=Future+Electronics; ComponentLink4Description: https://datasheet.ciiva.com/17081/pyu-rc0402-51-rohs-l-6-r-17081438.pdf?src-supplier=Future+Electronics; ComponentLink5URL: https://datasheet.ciiva.com/7850/1018594-7850170.pdf?src-supplier=Element14; ComponentLink5Description: https://datasheet.ciiva.com/7850/1018594-7850170.pdf?src-supplier=Element14; ComponentLink6URL: https://datasheet.ciiva.com/7850/1018594-7850171.pdf?src-supplier=Element14; ComponentLink6Description: https://datasheet.ciiva.com/7850/1018594-7850171.pdf?src-supplier=Element14; ComponentLink7URL: https://datasheet.ciiva.com/7983/1018594-7983558.pdf?src-supplier=Element14; ComponentLink7Description: https://datasheet.ciiva.com/7983/1018594-7983558.pdf?src-supplier=Element14; Supplier Part Number 1: 311-1.0KJRCT-ND
S2 = SW_SKSVCAE010: 2.8x1.9mm Compact Type with Projection Surface Mount SKSV Series Tact Switch; Manufacturer: Alps Electric; Supplier 1: Mouser; Manufacturer Part Number: SKSVCAE010; RoHS: Yes; Category: Tactile Switches; Stock 1: 17441; Pricing 1: 1=0.54000, 10=0.54000, 50=0.43600, 100=0.42100, 1000=0.37500, 10000=0.36200 (USD); RoHS Compliant: Yes; ComponentLink1URL: http://www.mouser.com/ds/2/15/ALPS_SKSVCAE010-463040.pdf?src-supplier=Mouser; ComponentLink1Description: http://www.mouser.com/ds/2/15/ALPS_SKSVCAE010-463040.pdf?src-supplier=Mouser; Supplier Part Number 1: 688-SKSVCAE010
TP3 TP4 = TP_PAD-1MM
U4 = LED_WS2812B-B: Intelligent control LED integrated light source; Manufacturer: WORLDSEMI; Manufacturer Part Number: WS2812B-B/W; Availability: Unavailable; Price: None; Package: None; MP: WS2812B-B; Value: *; Supplier 1: LCSC; RoHS: No; Category: Uncategorized; Stock 1: 70735; Pricing 1: 5=0.0923, 50=0.0756, 150=0.067, 1000=0.06, 2000=0.0575, 5000=0.0558 (USD); Supplier Part Number 1: C114586
U5 = IC_ESP32-S3: IC RF TxRx + MCU Bluetooth, WiFi 802.11b/g/n, Bluetooth v5.0 2.412GHz ~ 2.484GHz 56-VFQFN Exposed Pad; MF: Espressif Systems; Check_prices: https://www.snapeda.com/parts/ESP32-S3/Espressif+Systems/view-part/?ref=eda; Purchase-URL: https://pricing.snapeda.com/search/part/ESP32-S3/?ref=eda; Value: *; Availability: In Stock; Package: None; SnapEDA_Link: https://www.snapeda.com/parts/ESP32-S3/Espressif+Systems/view-part/?ref=snap; MP: ESP32-S3; Price: None; Supplier 1: LCSC; Supplier Part Number 1: C2913192
U6 = IC_W25Q128JVSIQ: NOR Flash Serial (SPI, Dual SPI, Quad SPI) 3.3V 128M-bit 16M x 8 6ns 8-Pin SOIC Tube; Manufacturer: Winbond; Memory Format: Non-Volatile,FLASH; Frequency: 133MHz; Memory Size: 128Mb; Supplier 1: Digi-Key; Manufacturer Part Number: W25Q128JVSIQ; RoHS: Yes; Category: Flash; Stock 1: 154352; Pricing 1: 1=1.71, 10=1.562, 25=1.52, 50=1.5124, 100=1.3519, 250=1.348, 500=1.32762, 1000=1.27127, 5000=1.18359 (USD); Mounting Technology: Surface Mount; Case/Package: SOIC; Min Operating Temperature: -40°C; Max Operating Temperature: 85°C; Packaging: Tray; Series: SpiFlash®; RoHS Compliant: Yes; ComponentLink1URL: http://www.winbond.com/resource-files/w25q128jv%20revf%2003272018%20plus.pdf?src-supplier=Digi-Key; ComponentLink1Description: http://www.winbond.com/resource-files/w25q128jv%20revf%2003272018%20plus.pdf?src-supplier=Digi-Key; Supplier Part Number 1: W25Q128JVSIQ-ND
X2 = XTAL_X321532768KGD2SI: 贴片无源晶振 32.768KHZ 12.5PF ±20ppm –40~+85 ℃; Manufacturer: YXC; Supplier 1: LCSC; Manufacturer Part Number: X321532768KGD2SI; RoHS: No; Supplier Part Number 1: C620155